# Altium project PA_test.PrjPcb
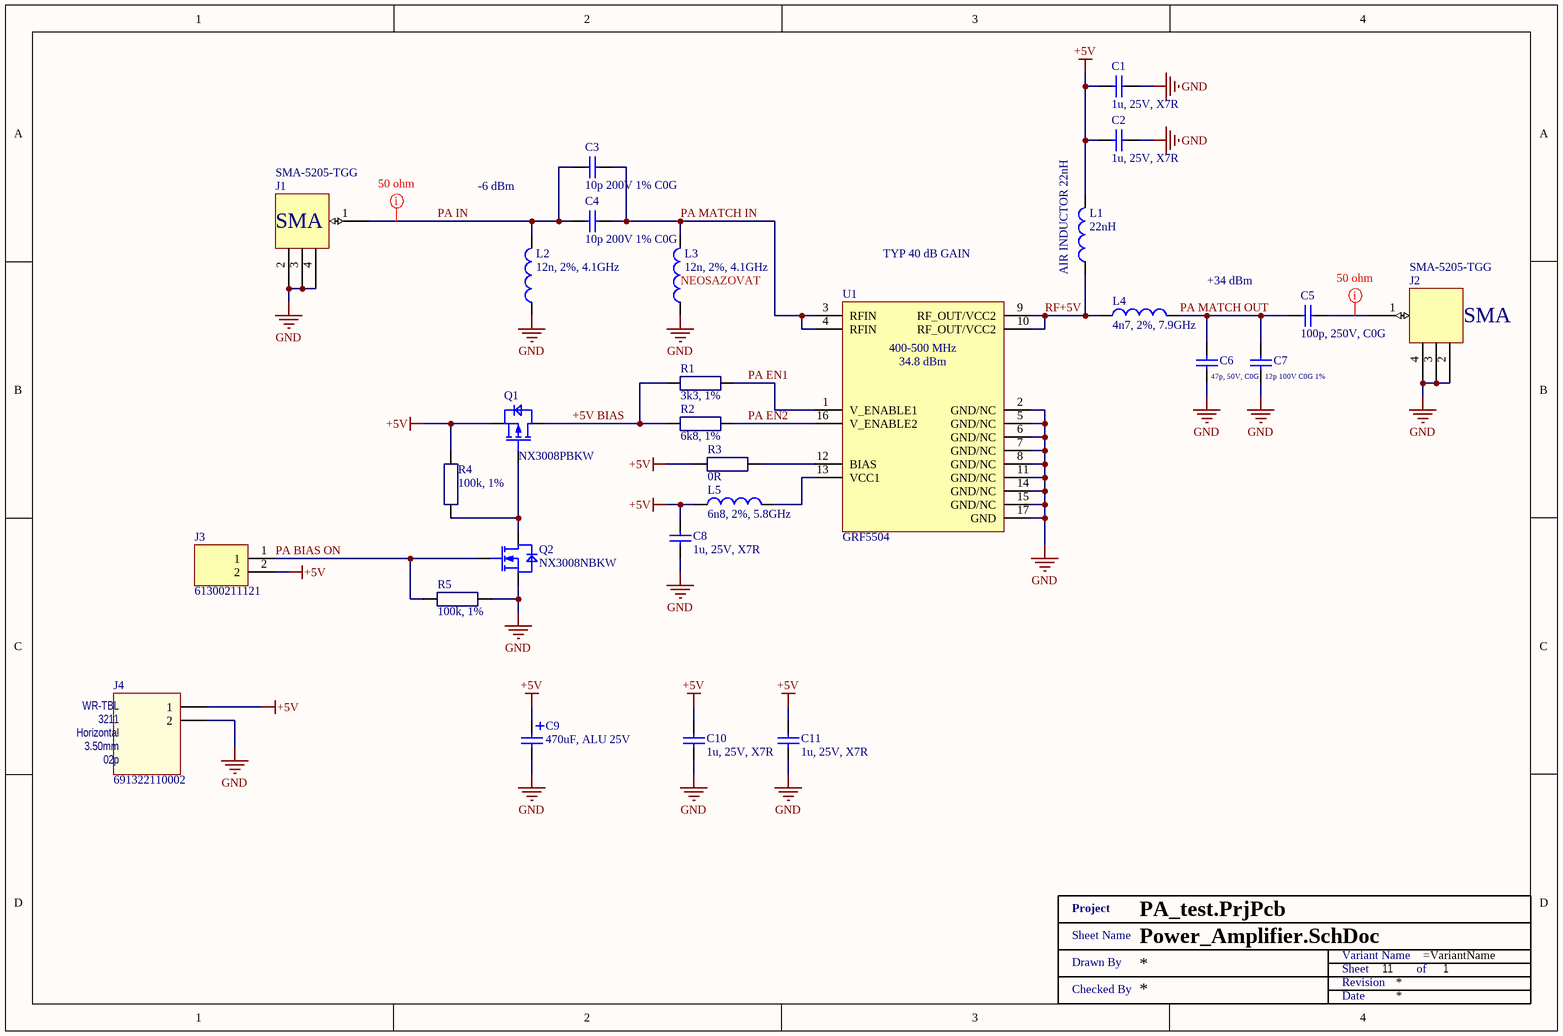
[diagram p0: Power_Amplifier.SchDoc]
1 sheet, 29 parts. Net scope: global (net labels, ports and power ports of the same name join across sheets).
Board file: PA_test.PcbDoc

## Sheet Power_Amplifier.SchDoc
size A4; DocumentNumber: 11; SheetNumber: 1; SheetTotal: 1

### Parts
C1  1u, 25V, X7R  [SMD0603]
C2  1u, 25V, X7R  [SMD0603]
C3  10p 200V 1% C0G  [SMD0603]
C4  10p 200V 1% C0G  [SMD0603]
C5  100p, 250V, C0G  [SMD0603]
C6  47p, 50V, C0G  [SMD0603]
C7  12p 100V C0G 1%  [SMD0603]
C8  1u, 25V, X7R  [SMD0603]
C9  470uF, ALU 25V  [WCAP-ATG8_8x11.5x3.5]
C10  1u, 25V, X7R  [SMD0603]
C11  1u, 25V, X7R  [SMD0603]
J1  SMA-5205-TGG  [SMA-5205-TGG]
J2  SMA-5205-TGG  [SMA-5205-TGG]
J3  61300211121  [Header 2 2.54mm]
J4  691322110002  [691322110002]
L1  22nH  [Air-Inductor-25nH]
L2  12n, 2%, 4.1GHz  [SMD0603 - L]
L3  12n, 2%, 4.1GHz  [SMD0603 - L]
L4  4n7, 2%, 7.9GHz  [SMD0603 - L]
L5  6n8, 2%, 5.8GHz  [SMD0603 - L]
Q1  NX3008PBKW  [SOT323]
Q2  NX3008NBKW  [SOT323]
R1  3k3, 1%  [SMD0603 - R]
R2  6k8, 1%  [SMD0603 - R]
R3  0R  [SMD0603 - R]
R4  100k, 1%  [SMD0603 - R]
R5  100k, 1%  [SMD0603 - R]
U1  GRF5504  [QFN50P300X300X80_HS-17M - os]
XX?  Title 1  (value not drawn)  (graphical)

### Nets
+5V: C1.1 C2.1 C8.1 C9.1 C10.1 C11.1 J3.2 J4.1 L1.2 L5.1 Q1.2(S) R3.1 R4.2
GND: C1.2 C2.2 C6.1 C7.1 C8.2 C9.2 C10.2 C11.2 J1.2(GND) J1.3(GND) J1.4(GND) J2.2(GND) J2.3(GND) J2.4(GND) J4.2 L2.1 L3.1 Q2.2(S) R5.1 U1.2(GND/NC) U1.5(GND/NC) U1.6(GND/NC) U1.7(GND/NC) U1.8(GND/NC) U1.11(GND/NC) U1.14(GND/NC) U1.15(GND/NC) U1.17(GND)
+5V BIAS: Q1.3(D) R1.1 R2.1
PA BIAS ON: J3.1 Q2.1(G) R5.2
PA EN1: R1.2 U1.1(V_ENABLE1)
PA EN2: R2.2 U1.16(V_ENABLE2)
PA IN: C3.2 C4.2 J1.1(S) L2.2
PA MATCH IN: C3.1 C4.1 L3.2 U1.3(RFIN) U1.4(RFIN)
PA MATCH OUT: C5.1 C6.2 C7.2 L4.2
RF+5V: L1.1 L4.1 U1.9(RF_OUT/VCC2) U1.10(RF_OUT/VCC2)
NetC5_2: C5.2 J2.1(S)
NetL5_2: L5.2 U1.13(VCC1)
NetQ1_1: Q1.1(G) Q2.3(D) R4.1
NetR3_2: R3.2 U1.12(BIAS)

### Layout directives
net class 50 ohm: NetC5_2, PA IN

### Notes on the sheet
- -6 dBm
- (near L3) NEOSAZOVAT
- TYP 40 dB GAIN
- (near L1) AIR INDUCTOR 22nH
- +34 dBm
- (in symbol 691322110002) WR-TBL; 3211; Horizontal; 3.50mm
- (in symbol GRF5504) 400-500 MHz; 34.8 dBm
- (in symbol SMA-5205-TGG) SMA
- (in symbol Title 1) Project; Sheet Name; Variant Name; Drawn By; Sheet; of; Revision; Checked By; Date

### Library data of the parts
C1 C2 C8 C10 C11 = CGA3E1X7R1E105K080AC: CAP CER 1UF 25V X7R 0603; Manufacturer: TDK Corporation; Tolerance: ±10%; Manufacturer Part Number: CGA3E1X7R1E105K080AC; RoHS: RoHS Compliant; Category: Capacitors; Stock 1: 109509; Pricing 1: 1=0.2, 10=0.135, 100=0.0686, 500=0.04696, 1000=0.04154 (USD); Packaging: Cut Tape (CT); Part Status: Active; Voltage - Rated: 25V; Temperature Coefficient: X7R; Operating Temperature: -55°C ~ 125°C; Features: -; Ratings: AEC-Q200; Applications: Automotive; Failure Rate: -; Mounting Type: Surface Mount, MLCC; Package / Case: 0603 (1608 Metric); Size / Dimension: 0.063" L x 0.032" W (1.60mm x 0.80mm); Height - Seated (Max): -; Thickness (Max): 0.035" (0.90mm); Lead Spacing: -; Lead Style: -; ComponentLink1URL: https://product.tdk.com/info/en/catalog/datasheets/mlcc_automotive_general_en.pdf; ComponentLink1Description: https://product.tdk.com/info/en/catalog/datasheets/mlcc_automotive_general_en.pdf; Capacitance: 1u; Supplier 1: Mouser; Supplier Part Number 1: 810-CGA3E1X7R1E105K; Supplier 2: Farnell; Supplier Part Number 2: 2346962; Supplier 3: Digi-Key; Supplier Part Number 3: 445-6931-1-ND
C3 C4 = 06032U100FAT2A: Cap Ceramic 10pF 200V C0G 1% Pad SMD 0603 125°C Ultra Low ESR T/R; Manufacturer: Kyocera AVX; Supplier 1: Mouser; Supplier Part Number 1: 581-06032U100FAT2A; Manufacturer Part Number: 06032U100FAT2A; RoHS: Yes; Category: Ceramic Capacitors; Stock 1: 12241; Pricing 1: 1=0.33, 10=0.227, 50=0.227, 100=0.137, 1000=0.087, 10000=0.07 (USD); ComponentLink1URL: https://datasheet.ciiva.com/219/useries-219573.pdf?src-supplier=Digi-Key; ComponentLink1Description: https://datasheet.ciiva.com/219/useries-219573.pdf?src-supplier=Digi-Key; ComponentLink2URL: https://datasheet.ciiva.com/16209/useries-16209209.pdf?src-supplier=Future+Electronics; ComponentLink2Description: https://datasheet.ciiva.com/16209/useries-16209209.pdf?src-supplier=Future+Electronics; Supplier 2: Arrow Electronics; Supplier Part Number 2: 06032U100FAT2A; Supplier 3: Newark; Supplier Part Number 3: 96Y8278; Capacitance: 10p
C5 = 885342006003: CAP CER 100PF 250V C0G/NP0 0603; Manufacturer: Wurth Electronics Inc.; Tolerance: ±5%; Temperature Coefficient: C0G, NP0; Notification: Current market demand for these product types have resulted in fluctuating and extending lead times. Lead times may differ.; Supplier 1: Digi-Key; Supplier Part Number 1: 732-12167-1-ND; Manufacturer Part Number: 885342006003; RoHS: RoHS Compliant; Category: Capacitors; Stock 1: 43; Pricing 1: 1=0.1, 10=0.043, 100=0.0385, 500=0.03406 (USD); Packaging: Cut Tape (CT); Part Status: Active; Voltage - Rated: 250V; Operating Temperature: -55°C ~ 125°C; Features: -; Ratings: -; Applications: General Purpose; Failure Rate: -; Mounting Type: Surface Mount, MLCC; Package / Case: 0603 (1608 Metric); Size / Dimension: 0.063" L x 0.031" W (1.60mm x 0.80mm); Height - Seated (Max): -; Thickness (Max): 0.034" (0.87mm); Lead Spacing: -; Lead Style: -; ComponentLink1URL: https://katalog.we-online.de/pbs/datasheet/885342006003.pdf; ComponentLink1Description: https://katalog.we-online.de/pbs/datasheet/885342006003.pdf; Supplier 2: Farnell; Supplier Part Number 2: 2812519; Supplier 3: Mouser; Supplier Part Number 3: 710-885342006003; Capacitance: 100p
C6 = C0603C470J5GACAUTO: CAP CER 47PF 50V C0G/NP0 0603; Manufacturer: KEMET; Tolerance: ±5%; Temperature Coefficient: C0G, NP0; Manufacturer Part Number: C0603C470J5GACAUTO; RoHS: RoHS Compliant; Category: Capacitors; Stock 1: 21519; Pricing 1: 1=0.12, 10=0.088, 100=0.0391, 500=0.02792, 1000=0.02193 (USD); Packaging: Cut Tape (CT); Part Status: Active; Voltage - Rated: 50V; Operating Temperature: -55°C ~ 125°C; Features: -; Ratings: AEC-Q200; Applications: Automotive; Failure Rate: -; Mounting Type: Surface Mount, MLCC; Package / Case: 0603 (1608 Metric); Size / Dimension: 0.063" L x 0.032" W (1.60mm x 0.80mm); Height - Seated (Max): -; Thickness (Max): 0.034" (0.87mm); Lead Spacing: -; Lead Style: -; ComponentLink1URL: https://search.kemet.com/component-edge/download/datasheet/C0603C470J5GACAUTO.pdf; ComponentLink1Description: https://search.kemet.com/component-edge/download/datasheet/C0603C470J5GACAUTO.pdf; Capacitance: 47p; Supplier 1: Mouser; Supplier Part Number 1: 80-C0603C470J5G; Supplier 2: Farnell; Supplier Part Number 2: 1414639; Supplier 3: Digi-Key; Supplier Part Number 3: 399-6890-1-ND; Supplier 4: TME; Supplier Part Number 4: C0603C470J5GAC
C7 = 06031U120FAT2A: Cap Ceramic 12pF 100V C0G 1% SMD 0603 125°C T/R; Manufacturer: Kyocera AVX; Supplier 1: Mouser; Supplier Part Number 1: 581-06031U120FAT2A; Manufacturer Part Number: 06031U120FAT2A; RoHS: Yes; Category: Ceramic Capacitors; Stock 1: 6418; Pricing 1: 1=0.33, 10=0.227, 50=0.227, 100=0.137, 1000=0.087, 10000=0.07 (USD); Mounting Technology: Surface Mount; Case/Package: 0603; Case Code (Metric): 1608; Case Code (Imperial): 0603; Min Operating Temperature: -55°C; Max Operating Temperature: 125°C; Packaging: Tape and Reel; Capacitance: 12p; Tolerance: 1%; Package Quantity: 4000; Voltage Rating: 100V; Voltage Rating (DC): 100V; Dielectric: C0G; Termination: SMD/SMT; Series: U; Construction: Flat; Length: 1.6mm; Width: 0.81mm; Depth: 0.76mm; Radiation Hardening: No; RoHS Compliant: Yes; ComponentLink1URL: https://datasheet.ciiva.com/208/useries-208490.pdf?src-supplier=Digi-Key; ComponentLink1Description: https://datasheet.ciiva.com/208/useries-208490.pdf?src-supplier=Digi-Key
C9 = 860010474013: WURTH ELEKTRONIK - 860010474013 - CAP, ALU ELEC, 470UF, 25V, RADIAL; Capacitance: 470u; Product Range: WCAP-ATG8 Series; Capacitance Tolerance: ± 20%; Capacitor Terminals: Radial Leaded; Lifetime @ Temperature: 2000 hours @ 85; SVHC: No SVHC (07-Jul-2017); Supplier 1: Farnell; Supplier Part Number 1: 2465681; Manufacturer: WURTH ELEKTRONIK; Manufacturer Part Number: 860010474013; RoHS: YES; Stock 1: 134; Pricing 1: 1=0.313, 3=0.282, 5=0.257, 10=0.232, 20=0.23, 50=0.189, 250=0.18 (GBP); Voltage Rating: 25V; Diameter: 8; Lead Spacing: 3.5; Height: 11.5; Operating Temperature Min: -40; Operating Temperature Max: 85; ESR: -; Automotive Qualification Standard: -; RoHS Phthalates Compliant: Yes; MSL: MSL 1 - Unlimited; Packaging: Each<!--FANDB--><div class="features-and-benefits-container"><div class="features-and-benefits-desc-container"><span class="features-and-benefits-container-desc">Electrolytic Capacitor, 470 µF, 25 V, WCAP-ATG8 Series, ± 20%, Radial Leaded, 8 mm</span></div></div>; ComponentLink1URL: http://www.farnell.com/datasheets/1879524.pdf; ComponentLink1Description: http://www.farnell.com/datasheets/1879524.pdf; Supplier 2: Digi-Key; Supplier Part Number 2: 732-8636-1-ND; Supplier 3: Mouser; Supplier Part Number 3: 710-860010474013
J1 J2 = SMA-5205-TGG: DC to 12.4 GHz, low cost SMA; Manufacturer: Schmid-M; Supplier 1: ATD Electronic; Supplier Part Number 1: SMA-5205-TGG
J3 = 61300211121: CONN HEADER 2 POS 2.54; Manufacturer: Wurth Electronics Inc.; Pitch - Mating: 0.100" (2.54mm); Number of Positions: 2; Number of Positions Loaded: All; Style: Board to Board or Cable; Shrouding: Unshrouded; Contact Length - Mating: 0.236" (6.00mm); Contact Length - Post: 0.118" (3.00mm); Overall Contact Length: 0.454" (11.54mm); Material Flammability Rating: UL94 V-0; Current Rating: 3A; Voltage Rating: 250V; Manufacturer Part Number: 61300211121; RoHS: RoHS Compliant; Category: Connectors, Interconnects; Stock 1: 164911; Pricing 1: 1=0.13, 10=0.106, 25=0.088, 50=0.074, 100=0.067, 1000=0.061 (USD); Packaging: Bulk; Part Status: Active; Connector Type: Header; Contact Type: Male Pin; Number of Rows: 1; Row Spacing - Mating: -; Mounting Type: Through Hole; Termination: Solder; Fastening Type: Push-Pull; Insulation Height: 0.100" (2.54mm); Contact Shape: Square; Contact Finish - Mating: Gold; Contact Finish Thickness - Mating: -; Contact Finish - Post: -; Contact Material: Copper Alloy; Insulation Material: Polybutylene Terephthalate (PBT); Features: -; Operating Temperature: -40°C ~ 125°C; Ingress Protection: -; Insulation Color: Black; Mated Stacking Heights: -; Contact Finish Thickness - Post: -; Applications: -; ComponentLink1URL: https://katalog.we-online.de/em/datasheet/6130xx11121.pdf; ComponentLink1Description: https://katalog.we-online.de/em/datasheet/6130xx11121.pdf; Supplier 1: Mouser; Supplier Part Number 1: 710-61300211121; Supplier 2: Farnell; Supplier Part Number 2: 2356153; Supplier 3: Digi-Key; Supplier Part Number 3: 732-5315-ND
J4 = 691322110002: WR-TBL Serie 3221 - 3.50 mm Horizontal PCB Header, 02p; Pitch: 3.5 mm; Published Date: Jan 2017; Publisher: Wurth Elektronik; ComponentLink1Description: Manufacturer; ComponentLink1URL: http://www.we-online.de; ComponentLink2Description: Datasheet; ComponentLink2URL: http://katalog.we-online.de/em/datasheet/6913221100xx.pdf; Part Number: 691322110002; Pin Number: 02p; Supplier 1: Digi-Key; Supplier Part Number 1: 732-2769-ND; Supplier 2: Farnell; Supplier Part Number 2: 1841315; Supplier 3: Mouser; Supplier Part Number 3: 710-691322110002
L1 = Air-Inductor_20nH
L2 L3 = 0603HP-12NXGLU: Fixed Inductors 0603HP Hi Perfrmnce 12 nH 2 % 1.1 A; Manufacturer: Coilcraft; Core Material: Ceramic; Q Factor: 91; Max DC Current: 1.1A; DC Resistance (DCR): 88mR; Test Frequency: 250MHz; Supplier 1: Mouser; Supplier Part Number 1: 994-0603HP-12NXGLU; Manufacturer Part Number: 0603HP-12NXGLU; Stock 1: 1052; Pricing 1: 1=1.18000, 10=1.18000, 50=1.18000, 100=1.18000, 200=0.89000, 500=0.66000, 1000=0.44000, 2000=0.40500 (USD); RoHS: Yes; Mount: Surface Mount; Case/Package: 0603; Case Code (Metric): 1608; Case Code (Imperial): 0603; Min Operating Temperature: -40°C; Max Operating Temperature: 125°C; Packaging: Cut Tape; Tolerance: 2%; Inductance: 12n; Self Resonant Frequency: 4.1GHz; Termination: SMD/SMT; Inductance Tolerance: 2%; Current Rating: 1.1A; Length: 1.75mm; Height: 0.94mm; Width: 1.09mm; Lead Free: Contains Lead; REACH SVHC: No SVHC; ComponentLink1URL: https://datasheet.ciiva.com/13167/0603hp-13167775.pdf?src-supplier=Mouser; ComponentLink1Description: https://datasheet.ciiva.com/13167/0603hp-13167775.pdf?src-supplier=Mouser; ComponentLink2URL: https://datasheet.ciiva.com/22680/1681881-22680847.pdf?src-supplier=Element14; ComponentLink2Description: https://datasheet.ciiva.com/22680/1681881-22680847.pdf?src-supplier=Element14; Supplier 2: Farnell; Supplier Part Number 2: 2286146
L4 = 0603HP-4N7XGLU: Fixed Inductors 0603HP Hi Perfrmnce 4.7 nH 2 % 1.1 A; Manufacturer: Coilcraft; Core Material: Ceramic; Q Factor: 75; Max DC Current: 1.1A; DC Resistance (DCR): 100mR; Test Frequency: 250MHz; Supplier 1: Mouser; Supplier Part Number 1: 994-0603HP-4N7XGLU; Manufacturer Part Number: 0603HP-4N7XGLU; Stock 1: 884; Pricing 1: 1=1.50000, 10=1.40000, 50=1.22000, 100=1.12000, 200=1.06000, 500=0.74800, 1000=0.47800, 2000=0.40500 (USD); RoHS: Yes; Mount: Surface Mount; Case/Package: 0603; Case Code (Metric): 1608; Case Code (Imperial): 0603; Min Operating Temperature: -40°C; Max Operating Temperature: 125°C; Packaging: Cut Tape; Tolerance: 2%; Inductance: 4n7; Self Resonant Frequency: 7.9GHz; Termination: SMD/SMT; Inductance Tolerance: 2%; Current Rating: 1.1A; Length: 1.75mm; Height: 0.94mm; Width: 1.09mm; Lead Free: Contains Lead; REACH SVHC: No SVHC; ComponentLink1URL: https://datasheet.ciiva.com/22680/1681881-22680887.pdf?src-supplier=Element14; ComponentLink1Description: https://datasheet.ciiva.com/22680/1681881-22680887.pdf?src-supplier=Element14; Supplier 2: Farnell; Supplier Part Number 2: 2286132
L5 = 0603HP-6N8XGLU: Fixed Inductors RF Chip Inductor 6.8 nH 2 % 1.4 A; Manufacturer: Coilcraft; Core Material: Ceramic; Q Factor: 143; Max DC Current: 1.4A; DC Resistance (DCR): 42mR; Test Frequency: 250MHz; Supplier 1: Mouser; Supplier Part Number 1: 994-0603HP-6N8XGLU; Manufacturer Part Number: 0603HP-6N8XGLU; Stock 1: 1868; Pricing 1: 1=1.18000, 10=1.18000, 50=1.18000, 100=1.18000, 200=0.89000, 500=0.66000, 1000=0.44000, 2000=0.40500 (USD); RoHS: Yes; Mount: Surface Mount; Case/Package: 0603; Case Code (Imperial): 0603; Case Code (Metric): 1608; Min Operating Temperature: -40°C; Max Operating Temperature: 125°C; Packaging: Cut Tape; Tolerance: 2%; Inductance: 6n8; Self Resonant Frequency: 5.8GHz; Termination: SMD/SMT; Inductance Tolerance: 2%; Current Rating: 1.4A; Length: 1.75mm; Height: 0.94mm; Width: 1.09mm; Lead Free: Contains Lead; REACH SVHC: No SVHC; ComponentLink1URL: https://datasheet.ciiva.com/22680/1681881-22680901.pdf?src-supplier=Element14; ComponentLink1Description: https://datasheet.ciiva.com/22680/1681881-22680901.pdf?src-supplier=Element14; ComponentLink2URL: https://datasheet.ciiva.com/13143/0603hp-13143195.pdf?src-supplier=Mouser; ComponentLink2Description: https://datasheet.ciiva.com/13143/0603hp-13143195.pdf?src-supplier=Mouser; ComponentLink3URL: https://datasheet.ciiva.com/22709/1681881-22709629.pdf?src-supplier=Element14; ComponentLink3Description: https://datasheet.ciiva.com/22709/1681881-22709629.pdf?src-supplier=Element14; Supplier 2: Farnell; Supplier Part Number 2: 2286136
Q1 = NX3008PBKW: NXP - NX3008PBKW - MOSFET, P CH, 30V, 200MA, SOT323; Transistor Polarity: P Channel; Continuous Drain Current Id: -200; Drain Source Voltage Vds: -30; On Resistance Rds(on): 2.8; Rds(on) Test Voltage Vgs: -4.5; Threshold Voltage Vgs: -900; Power Dissipation Pd: 260; Transistor Case Style: SOT-323; No. of Pins: 3; SVHC: No SVHC (17-Dec-2015); Pulse Current Idm: -0.8; Voltage Vgs th Max: 8V<!--FANDB--><div class="features-and-benefits-container"><div class="features-and-benefits-description"><span class="features-benefits-value">The NX3008PBKW is a P-channel enhancement mode Field-Effect Transistor (FET) in surface mount plastic package using Trench MOSFET technology. Suitable for relay driver, high-speed line driver and high-side loadswitch.</span></div><div class="features-and-benefits-list"><ul class="features-and-benefits-list-list"><li class="features-and-benefits-list-item">Logic-level compatible</li><li class="features-and-benefits-list-item">Very fast switching</li><li class="features-and-benefits-list-item">AEC-Q101 Qualified</li><li class="features-and-benefits-list-item">Up to 1; Supplier 1: Farnell; Supplier Part Number 1: 2069551; Manufacturer: NXP; Manufacturer Part Number: NX3008PBKW; RoHS: YES; Stock 1: 18626; Pricing 1: 1=0.037, 25=0.0347, 100=0.0323, 250=0.03, 500=0.0294, 2000=0.0288, 4000=0.0282, 20000=0.0276 (GBP); Operating Temperature Max: 150; Product Range: -; Automotive Qualification Standard: -; MSL: MSL 1 - Unlimited; Operating Temperature Min: -55; Operating Temperature Range: -55°C to +150; ComponentLink1URL: http://www.farnell.com/datasheets/1508398.pdf; ComponentLink1Description: http://www.farnell.com/datasheets/1508398.pdf; Supplier 2: Digi-Key; Supplier Part Number 2: 568-10503-1-ND
Q2 = NX3008NBKW: NXP - NX3008NBKW - MOSFET, N CH, 30V, 350MA, SOT323; Transistor Polarity: N Channel; Continuous Drain Current Id: 350; Drain Source Voltage Vds: 30; On Resistance Rds(on): 1; Rds(on) Test Voltage Vgs: 4.5; Threshold Voltage Vgs: 900; Power Dissipation Pd: 260; Transistor Case Style: SOT-323; No. of Pins: 3; SVHC: No SVHC (17-Dec-2015); Pulse Current Idm: -0.8; Voltage Vgs th Max: 8; Manufacturer: NXP; Manufacturer Part Number: NX3008NBKW; RoHS: YES; Stock 1: 4764; Pricing 1: 1=0.0425, 25=0.0385, 100=0.0347, 250=0.0334, 500=0.0312, 2000=0.0291, 4000=0.0282, 20000=0.0273 (GBP); Operating Temperature Max: 150; Product Range: -; Automotive Qualification Standard: -; MSL: MSL 1 - Unlimited; Operating Temperature Min: -55; Operating Temperature Range: -55°C to +150; ComponentLink1URL: http://www.farnell.com/datasheets/1508392.pdf; ComponentLink1Description: http://www.farnell.com/datasheets/1508392.pdf; Supplier 1: Mouser; Supplier Part Number 1: 771-NX3008NBKW,115; Supplier 2: Farnell; Supplier Part Number 2: 2069546; Supplier 3: Arrow; Supplier Part Number 3: NX3008NBKW,115
R1 = RC0603FR-073K3L: YAGEO - RC0603FR-073K3L - SMD Chip Resistor, 0603 [1608 Metric], 3.3 kohm, RC Series, 75 V, Thick Film, 100 mW; Voltage Rating (DC): 50V; Temperature Coefficient: 100ppm/°C; Power Rating: 100mW; Supplier 1: Mouser; Supplier Part Number 1: 603-RC0603FR-073K3L; Manufacturer: Yageo; Manufacturer Part Number: RC0603FR-073K3L; RoHS: Yes; Category: Chip SMD Resistors; Stock 1: 695285; Pricing 1: 1=0,10000, 10=0,01800, 100=0,00600, 1000=0,00500, 5000=0,00300, 10000=0,00300 (USD); Case/Package: 0603; Number of Pins: 2; Case Code (Imperial): 0603; Case Code (Metric): 1608; Min Operating Temperature: -55°C; Max Operating Temperature: 155°C; Resistance: 3k3; Tolerance: 1%; Packaging: Tape and Reel; Composition: Thick Film; Voltage Rating: 50V; Package Quantity: 1; Termination: SMD/SMT; Number of Terminations: 2; Military Standard: Not; Max Power Dissipation: 100mW; Features: Moisture Resistant; Length: 1.6mm; Height: 0.45mm; Width: 0.8mm; Depth: 0.8mm; REACH SVHC: No SVHC; Lead Free: Lead Free; ComponentLink1URL: https://datasheet.ciiva.com/2453/pyu-r-int-thick-7-2453926.pdf?src-supplier=Digi-Key; ComponentLink1Description: https://datasheet.ciiva.com/2453/pyu-r-int-thick-7-2453926.pdf?src-supplier=Digi-Key; ComponentLink2URL: https://datasheet.ciiva.com/2453/pyu-r-int-thick-7-2453927.pdf?src-supplier=Digi-Key; ComponentLink2Description: https://datasheet.ciiva.com/2453/pyu-r-int-thick-7-2453927.pdf?src-supplier=Digi-Key; ComponentLink3URL: https://datasheet.ciiva.com/7746/443971-7746344.pdf?src-supplier=Element14; ComponentLink3Description: https://datasheet.ciiva.com/7746/443971-7746344.pdf?src-supplier=Element14; ComponentLink4URL: https://datasheet.ciiva.com/7746/1686128-7746345.pdf?src-supplier=Element14; ComponentLink4Description: https://datasheet.ciiva.com/7746/1686128-7746345.pdf?src-supplier=Element14; ComponentLink5URL: https://datasheet.ciiva.com/46440/1868787-46440905.pdf?src-supplier=Element14; ComponentLink5Description: https://datasheet.ciiva.com/46440/1868787-46440905.pdf?src-supplier=Element14; ComponentLink6URL: https://datasheet.ciiva.com/7746/443971-7746346.pdf?src-supplier=Element14; ComponentLink6Description: https://datasheet.ciiva.com/7746/443971-7746346.pdf?src-supplier=Element14; Supplier 2: Farnell; Supplier Part Number 2: 2421870; Supplier 3: Digi-Key; Supplier Part Number 3: 311-3.30KHRCT-ND
R2 = RC0603FR-076K8L: Res Thick Film 0603 6.8K Ohm 1% 0.1W(1/10W) ±100ppm/C Pad SMD T/R; Manufacturer: Yageo; Voltage Rating (DC): 50V; Power Rating: 100mW; Temperature Coefficient: 100ppm/°C; Supplier 1: Mouser; Supplier Part Number 1: 603-RC0603FR-076K8L; Manufacturer Part Number: RC0603FR-076K8L; RoHS: Yes; Category: Chip SMD Resistors; Stock 1: 241804; Pricing 1: 1=0,10000, 10=0,01800, 100=0,00600, 1000=0,00500, 5000=0,00300, 10000=0,00300 (USD); Case/Package: 0603; Number of Pins: 2; Case Code (Imperial): 0603; Case Code (Metric): 1608; Min Operating Temperature: -55°C; Max Operating Temperature: 155°C; Packaging: Tape and Reel; Resistance: 6k8; Tolerance: 1%; Voltage Rating: 50V; Package Quantity: 1; Termination: SMD/SMT; Composition: Thick Film; Number of Terminations: 2; Military Standard: Not; Max Power Dissipation: 100mW; Features: Moisture Resistant; Length: 0.063inch; Height: 0.022inch; Width: 0.031inch; Depth: 0.8mm; REACH SVHC: No SVHC; Lead Free: Lead Free; ComponentLink1URL: https://datasheet.ciiva.com/46412/443971-46412856.pdf?src-supplier=Element14; ComponentLink1Description: https://datasheet.ciiva.com/46412/443971-46412856.pdf?src-supplier=Element14; ComponentLink2URL: https://datasheet.ciiva.com/7746/443971-7746394.pdf?src-supplier=Element14; ComponentLink2Description: https://datasheet.ciiva.com/7746/443971-7746394.pdf?src-supplier=Element14; ComponentLink3URL: https://datasheet.ciiva.com/7746/443971-7746395.pdf?src-supplier=Element14; ComponentLink3Description: https://datasheet.ciiva.com/7746/443971-7746395.pdf?src-supplier=Element14; ComponentLink4URL: https://datasheet.ciiva.com/2454/pyu-r-int-thick-7-2454156.pdf?src-supplier=Digi-Key; ComponentLink4Description: https://datasheet.ciiva.com/2454/pyu-r-int-thick-7-2454156.pdf?src-supplier=Digi-Key; ComponentLink5URL: https://datasheet.ciiva.com/2454/pyu-r-int-thick-7-2454157.pdf?src-supplier=Digi-Key; ComponentLink5Description: https://datasheet.ciiva.com/2454/pyu-r-int-thick-7-2454157.pdf?src-supplier=Digi-Key; ComponentLink6URL: https://datasheet.ciiva.com/2454/pyu-r-int-thick-7-2454158.pdf?src-supplier=Digi-Key; ComponentLink6Description: https://datasheet.ciiva.com/2454/pyu-r-int-thick-7-2454158.pdf?src-supplier=Digi-Key; ComponentLink7URL: https://datasheet.ciiva.com/7983/443971-7983662.pdf?src-supplier=Element14; ComponentLink7Description: https://datasheet.ciiva.com/7983/443971-7983662.pdf?src-supplier=Element14; ComponentLink8URL: https://datasheet.ciiva.com/46371/1868787-46371519.pdf?src-supplier=Element14; ComponentLink8Description: https://datasheet.ciiva.com/46371/1868787-46371519.pdf?src-supplier=Element14; Supplier 2: Farnell; Supplier Part Number 2: 2421883; Supplier 3: Digi-Key; Supplier Part Number 3: 311-6.80KHRCT-ND
R3 = CRCW06030000Z0EA: RES SMD 0 OHM JUMPER 1/10W 0603; Manufacturer: Vishay Dale; Power (Watts): 0.1W, 1/10W; Manufacturer Part Number: CRCW06030000Z0EA; RoHS: RoHS Compliant; Category: Resistors; Stock 1: 0; Pricing 1: 1=0.1, 10=0.028, 25=0.0204, 50=0.0154, 100=0.0114, 250=0.00868, 500=0.00694, 1000=0.00511 (USD); Packaging: Cut Tape (CT); Part Status: Active; Tolerance: Jumper; Composition: Thick Film; Features: Automotive AEC-Q200; Temperature Coefficient: -; Operating Temperature: -55°C ~ 155°C; Package / Case: 0603 (1608 Metric); Supplier Device Package: 0603; Size / Dimension: 0.063" L x 0.033" W (1.60mm x 0.85mm); Height - Seated (Max): 0.020" (0.50mm); Failure Rate: -; ComponentLink1URL: http://www.vishay.com/docs/20035/dcrcwe3.pdf; ComponentLink1Description: http://www.vishay.com/docs/20035/dcrcwe3.pdf; Resistance: 0R; Supplier 1: Mouser; Supplier Part Number 1: 71-CRCW0603-0-E3; Supplier 2: Farnell; Supplier Part Number 2: 1469739; Supplier 3: Digi-Key; Supplier Part Number 3: 541-0.0GCT-ND
R4 R5 = RC0603FR-07100KL: RES SMD 100K OHM 1% 1/10W 0603; Manufacturer: Yageo; Power (Watts): 0.1W, 1/10W; Temperature Coefficient: ±100ppm/°C; Manufacturer Part Number: RC0603FR-07100KL; RoHS: RoHS Compliant; Category: Resistors; Stock 1: 14618646; Pricing 1: 1=0.1, 10=0.015, 100=0.006, 1000=0.00268, 2500=0.00233 (USD); Packaging: Cut Tape (CT); Part Status: Active; Tolerance: ±1%; Composition: Thick Film; Features: Moisture Resistant; Operating Temperature: -55°C ~ 155°C; Package / Case: 0603 (1608 Metric); Supplier Device Package: 0603; Size / Dimension: 0.063" L x 0.032" W (1.60mm x 0.80mm); Height - Seated (Max): 0.022" (0.55mm); Failure Rate: -; ComponentLink1URL: http://www.yageo.com/documents/recent/PYu-RC_Group_51_RoHS_L_8.pdf; ComponentLink1Description: http://www.yageo.com/documents/recent/PYu-RC_Group_51_RoHS_L_8.pdf; Resistance: 100k; Supplier 1: Mouser; Supplier Part Number 1: 603-RC0603FR-07100KL; Supplier 2: Farnell; Supplier Part Number 2: 9238727; Supplier 3: Digi-Key; Supplier Part Number 3: 311-100KHRCT-ND
U1 = GRF5504: Amplifier, Power, 0.4–0.5 GHz, 41.0 dB, 34.8 dBm, 3.0 x 3.0 mm QFN-16; Manufacturer: Guerrilla RF; Supplier 1: Mouser; Supplier Part Number 1: 459-GRF5504; Manufacturer Part Number: GRF5504; RoHS: No; Category: LDO; Stock 1: 6789; Pricing 1: 1=6.08, 10=5.78, 50=5.78, 100=5.33, 1000=2.39, 10000=2.03 (USD); Supplier 2: Richardson RFPD; Supplier Part Number 2: GRF5504